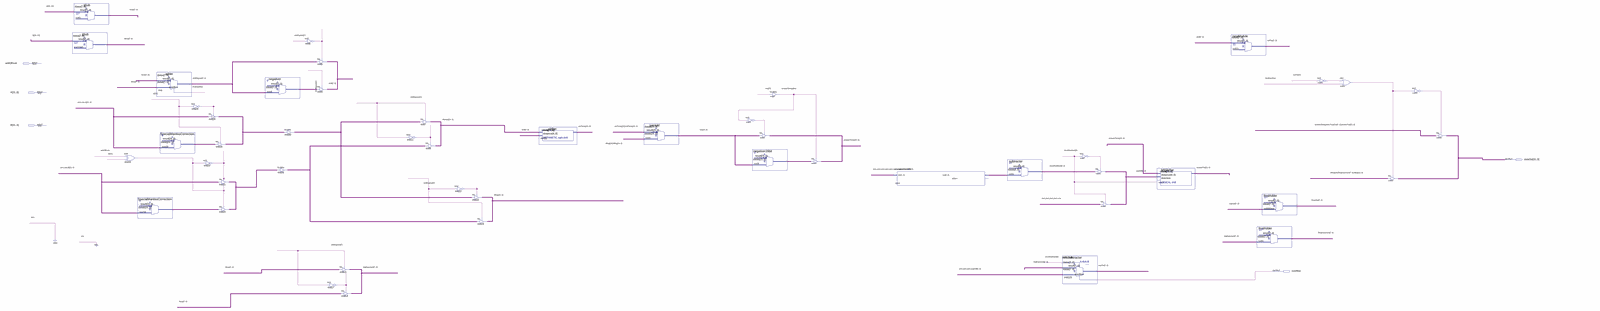
[diagram p0: schematic sheet, whole]
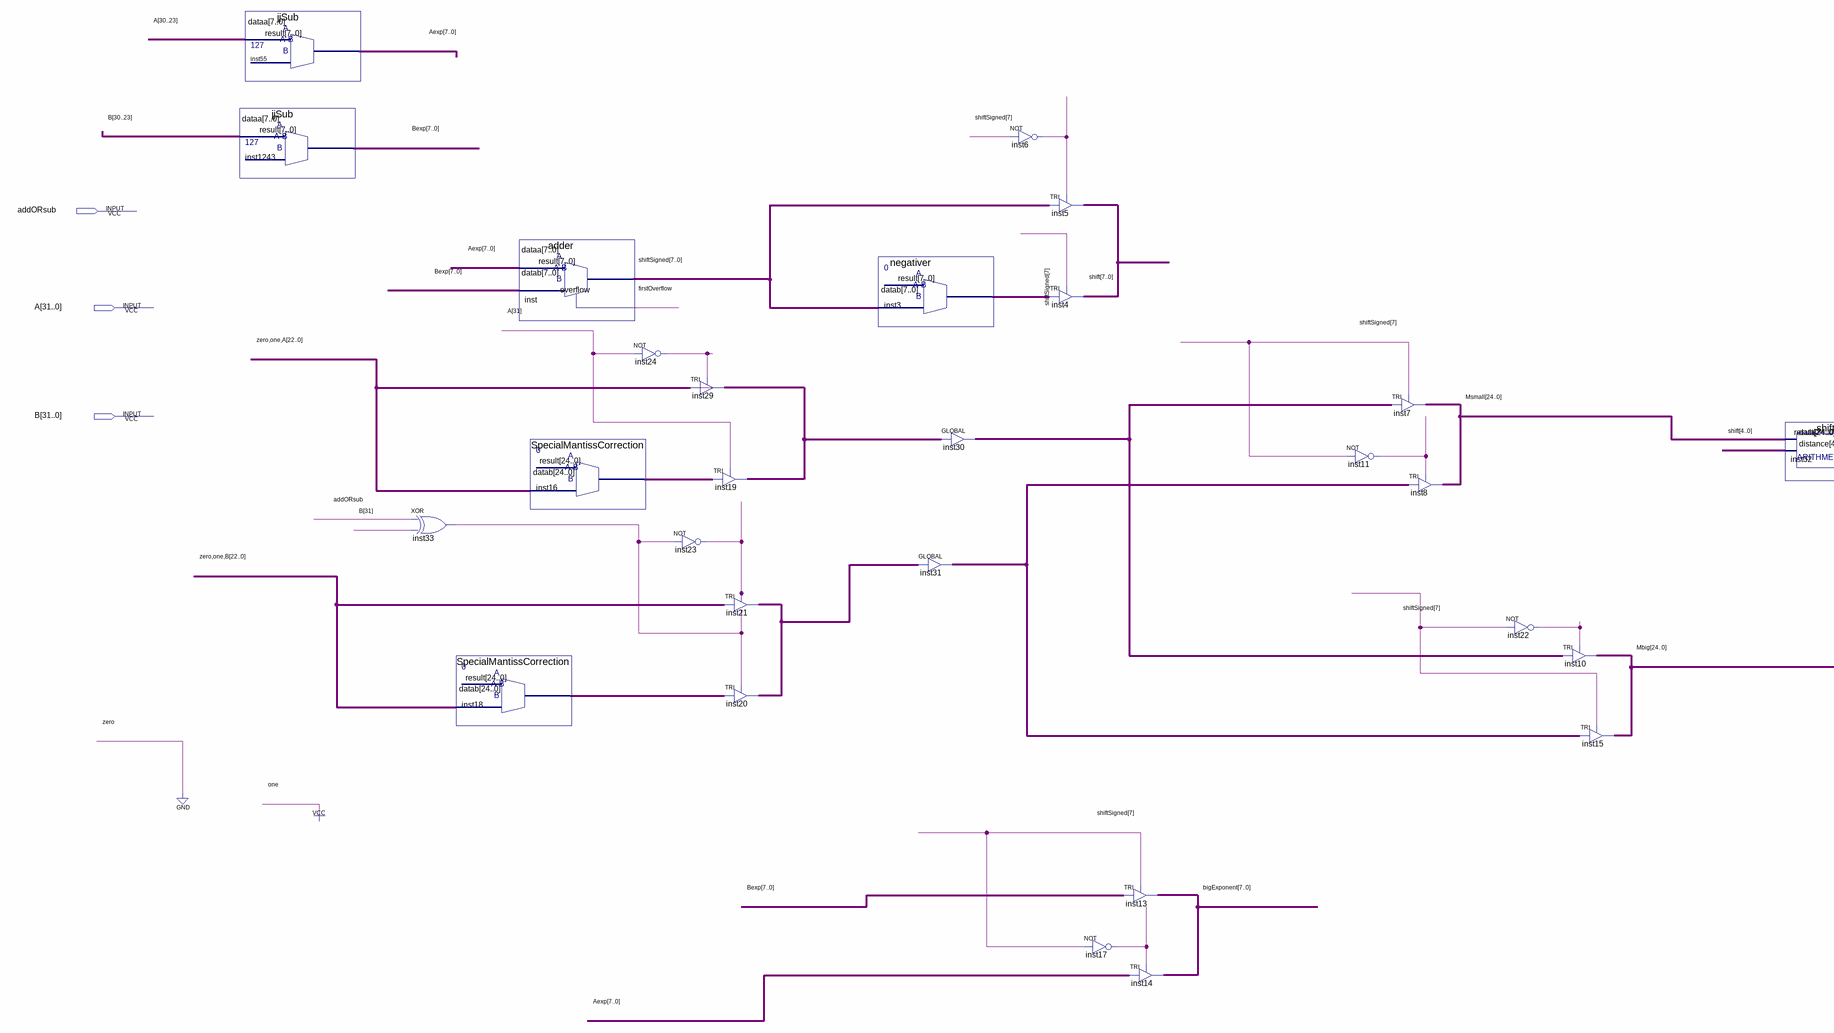
[diagram p1: schematic sheet, left part]
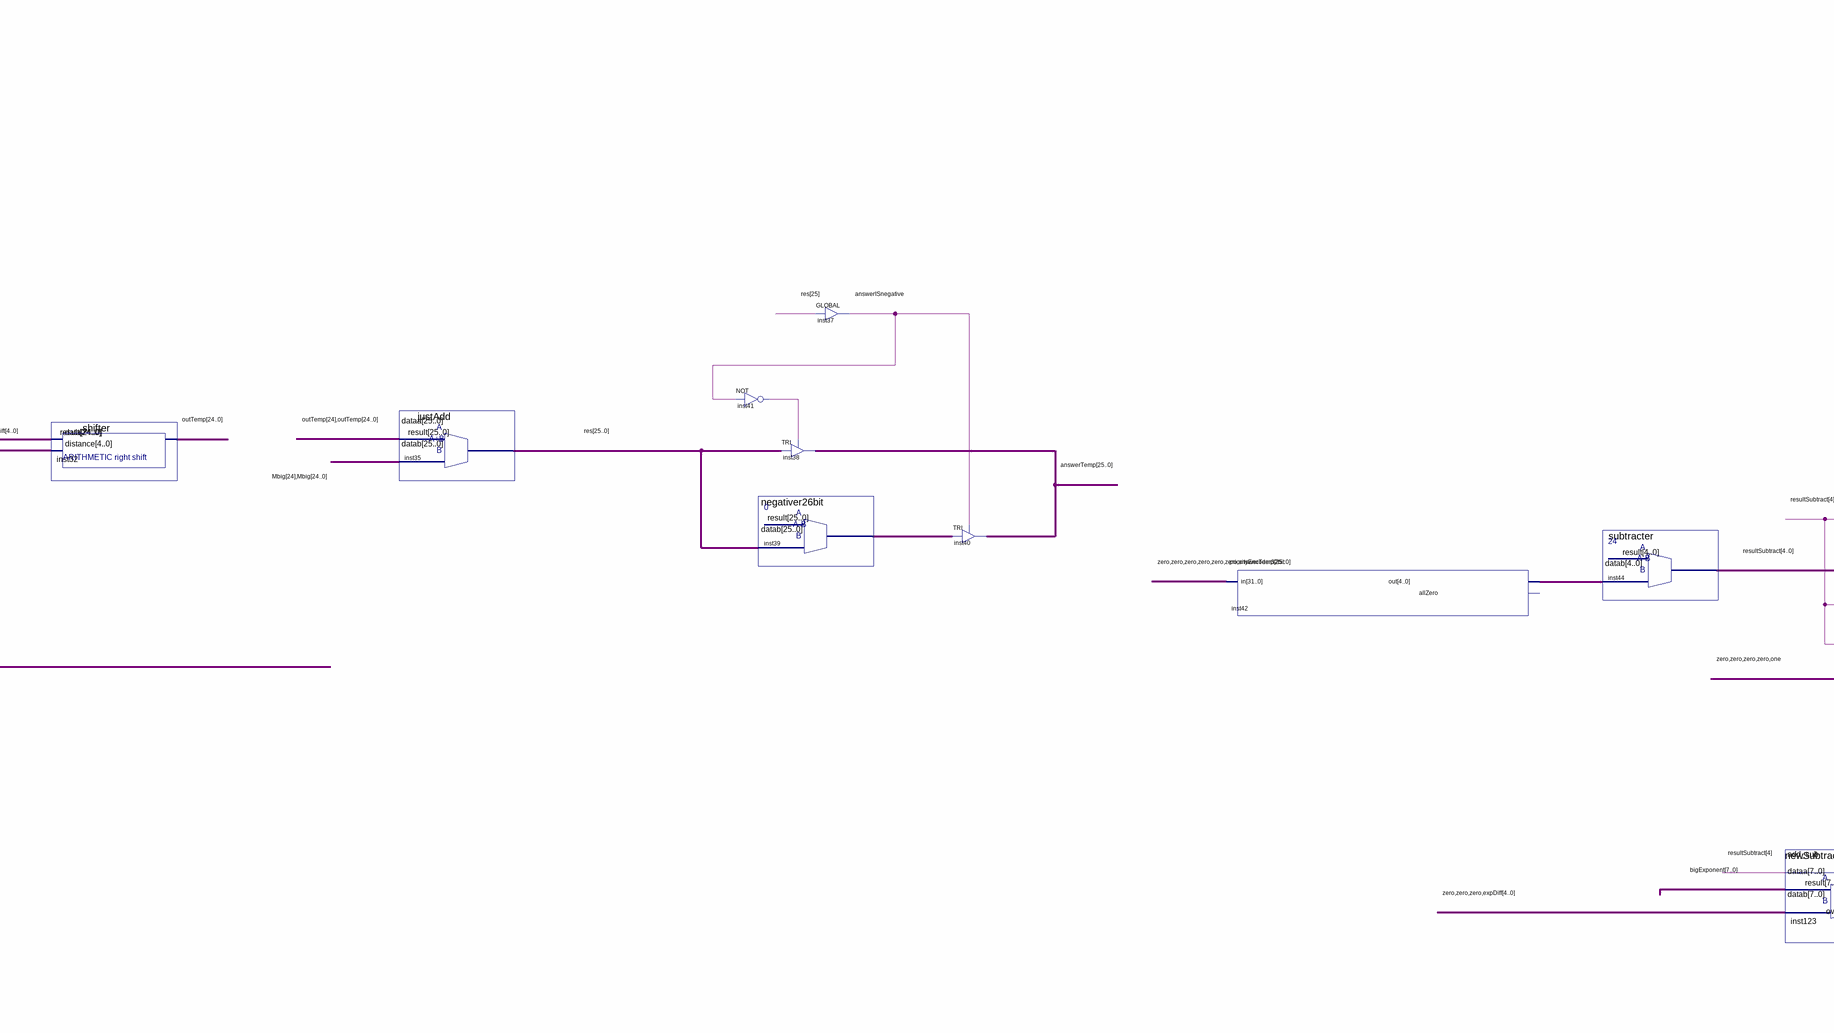
[diagram p2: schematic sheet, centre part]
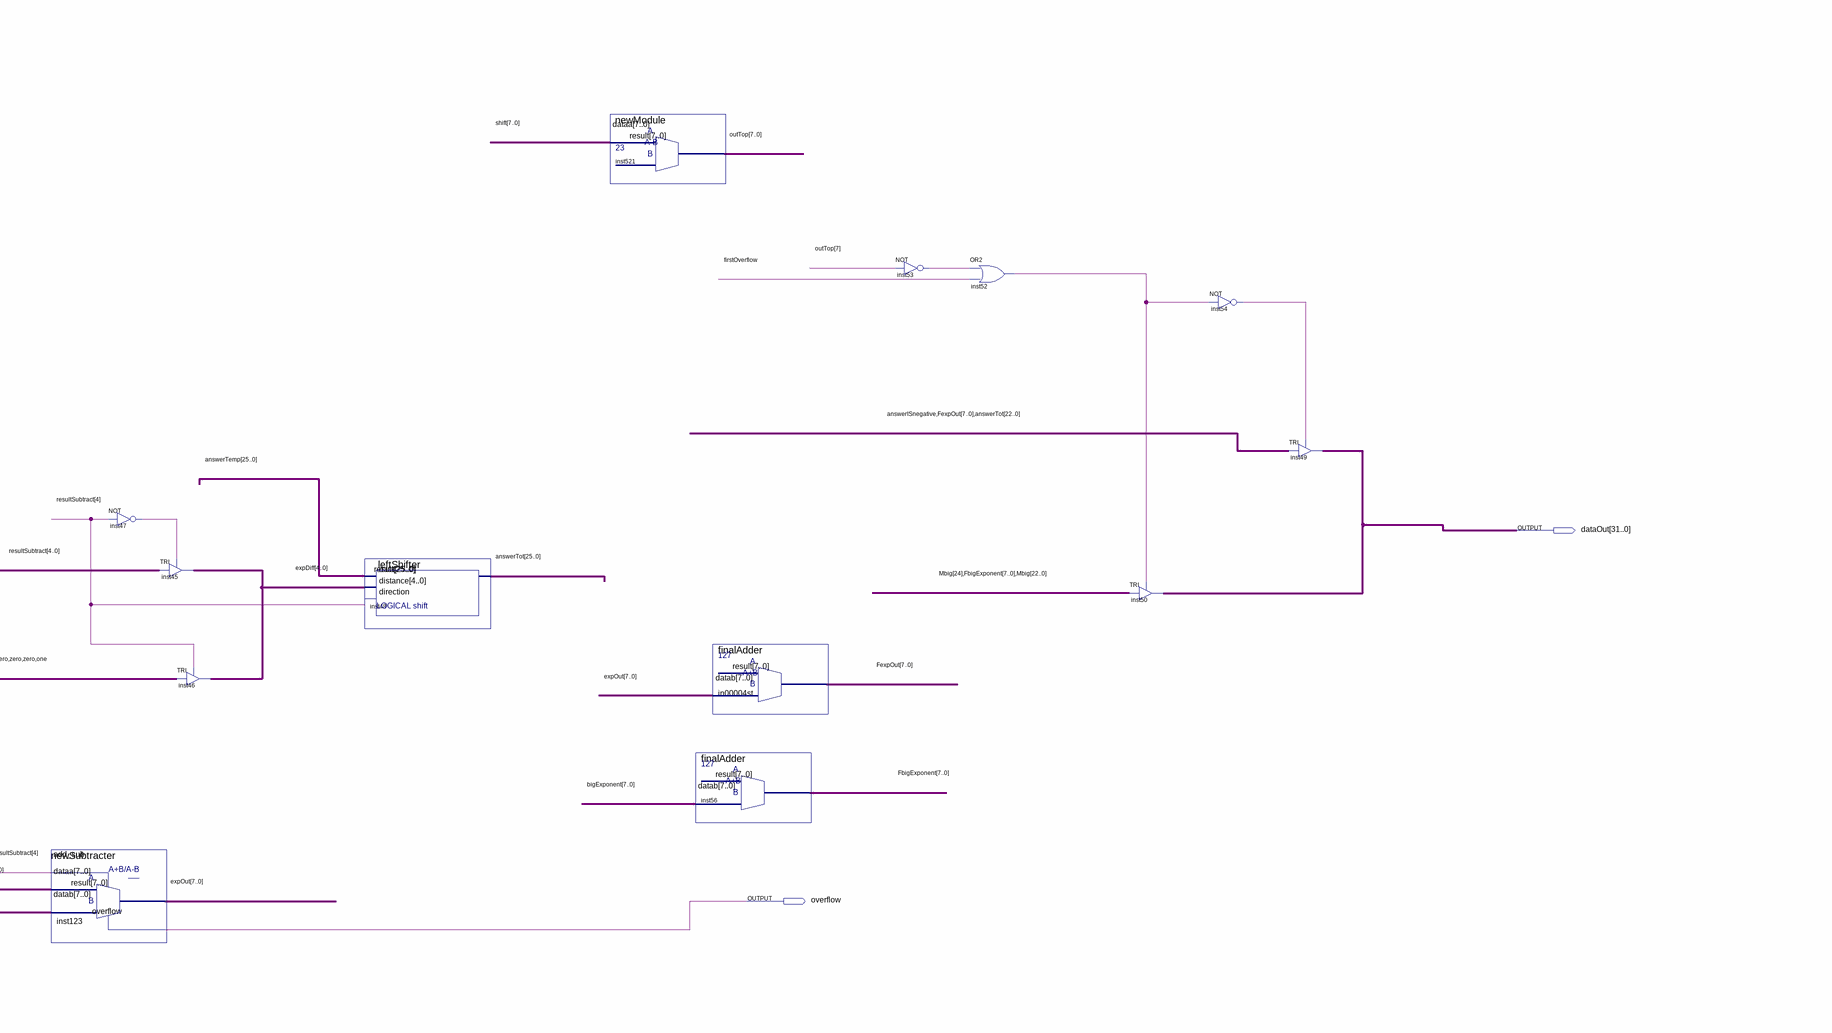
[diagram p3: schematic sheet, right part]
// Quartus schematic fpuPlusMinus.bdf as structural Verilog: 49 symbols, 5 pins
module fpuPlusMinus (
  input  addORsub,
  input  [31:0] A,
  input  [31:0] B,
  output [31:0] dataOut,
  output overflow
);

  wire answerISnegative, firstOverflow, inst6_out, inst11_out, inst17_out, inst22_out, inst23_out,
       inst24_out, inst33_out, inst41_out, inst47_out, inst52_out, inst53_out, inst54_out;
  wire [4:0] expDiff, inst42_out, resultSubtract;
  wire [7:0] Aexp, Bexp, bigExponent, expOut, FbigExponent, FexpOut, inst3_result, outTop, shift, shiftSigned;
  wire [24:0] inst16_result, inst18_result, inst21_out, inst29_out, inst30_out, inst31_out, Mbig, Msmall,
       outTemp;
  wire [25:0] answerTemp, answerTot, inst39_result, res;

  jjSub inst55 (.dataa(A[30:23]), .result(Aexp));
  jjSub inst1243 (.dataa(B[30:23]), .result(Bexp));
  xor inst33 (inst33_out, addORsub, B[31]);
  SpecialMantissCorrection inst18 (.datab({2'b01, B[22:0]}), .result(inst18_result));
  adder inst (.dataa(Aexp), .datab(Bexp), .result(shiftSigned), .overflow(firstOverflow));
  SpecialMantissCorrection inst16 (.datab({2'b01, A[22:0]}), .result(inst16_result));
  not inst24 (inst24_out, A[31]);
  not inst23 (inst23_out, inst33_out);
  TRI inst29[24:0] (.IN({2'b01, A[22:0]}), .OE(inst24_out), .OUT(inst29_out));
  TRI inst19[24:0] (.IN(inst16_result), .OE(A[31]), .OUT(inst29_out));
  TRI inst21[24:0] (.IN({2'b01, B[22:0]}), .OE(inst23_out), .OUT(inst21_out));
  TRI inst20[24:0] (.IN(inst18_result), .OE(inst33_out), .OUT(inst21_out));
  negativer inst3 (.datab(shiftSigned), .result(inst3_result));
  GLOBAL inst30[24:0] (.IN(inst29_out), .OUT(inst30_out));
  GLOBAL inst31[24:0] (.IN(inst21_out), .OUT(inst31_out));
  not inst6 (inst6_out, shiftSigned[7]);
  TRI inst5[7:0] (.IN(shiftSigned), .OE(inst6_out), .OUT(shift));
  TRI inst4[7:0] (.IN(inst3_result), .OE(shiftSigned[7]), .OUT(shift));
  not inst17 (inst17_out, shiftSigned[7]);
  TRI inst13[7:0] (.IN(Bexp), .OE(shiftSigned[7]), .OUT(bigExponent));
  TRI inst14[7:0] (.IN(Aexp), .OE(inst17_out), .OUT(bigExponent));
  not inst11 (inst11_out, shiftSigned[7]);
  TRI inst7[24:0] (.IN(inst30_out), .OE(shiftSigned[7]), .OUT(Msmall));
  TRI inst8[24:0] (.IN(inst31_out), .OE(inst11_out), .OUT(Msmall));
  not inst22 (inst22_out, shiftSigned[7]);
  TRI inst10[24:0] (.IN(inst30_out), .OE(inst22_out), .OUT(Mbig));
  TRI inst15[24:0] (.IN(inst31_out), .OE(shiftSigned[7]), .OUT(Mbig));
  shifter inst32 (.data(Msmall), .distance(shift[4:0]), .result(outTemp));
  justAdd inst35 (.dataa({{2{outTemp[24]}}, outTemp[23:0]}), .datab({{2{Mbig[24]}}, Mbig[23:0]}), .result(res));
  not inst41 (inst41_out, answerISnegative);
  negativer26bit inst39 (.datab(res), .result(inst39_result));
  GLOBAL inst37 (.IN(res[25]), .OUT(answerISnegative));
  TRI inst38[25:0] (.IN(res), .OE(inst41_out), .OUT(answerTemp));
  TRI inst40[25:0] (.IN(inst39_result), .OE(answerISnegative), .OUT(answerTemp));
  priorityEncoder32bit inst42 (.in({{6{1'b0}}, answerTemp}), .out(inst42_out));  // open: allZero
  subtracter inst44 (.datab(inst42_out), .result(resultSubtract));
  newSubtracter inst123 (
    .add_sub(resultSubtract[4]), .dataa(bigExponent), .datab({3'b000, expDiff}), .result(expOut),
    .overflow(overflow));
  not inst47 (inst47_out, resultSubtract[4]);
  TRI inst45[4:0] (.IN(resultSubtract), .OE(inst47_out), .OUT(expDiff));
  TRI inst46[4:0] (.IN(5'b00001), .OE(resultSubtract[4]), .OUT(expDiff));
  leftShifter inst48 (.data(answerTemp), .distance(expDiff), .direction(resultSubtract[4]), .result(answerTot));
  newModule inst521 (.dataa(shift), .result(outTop));
  finalAdder in00004st (.datab(expOut), .result(FexpOut));
  finalAdder inst56 (.datab(bigExponent), .result(FbigExponent));
  not inst53 (inst53_out, outTop[7]);
  or inst52 (inst52_out, inst53_out, firstOverflow);
  TRI inst50[31:0] (.IN({Mbig[24], FbigExponent, Mbig[22:0]}), .OE(inst52_out), .OUT(dataOut));
  not inst54 (inst54_out, inst52_out);
  TRI inst49[31:0] (.IN({answerISnegative, FexpOut, answerTot[22:0]}), .OE(inst54_out), .OUT(dataOut));
endmodule
